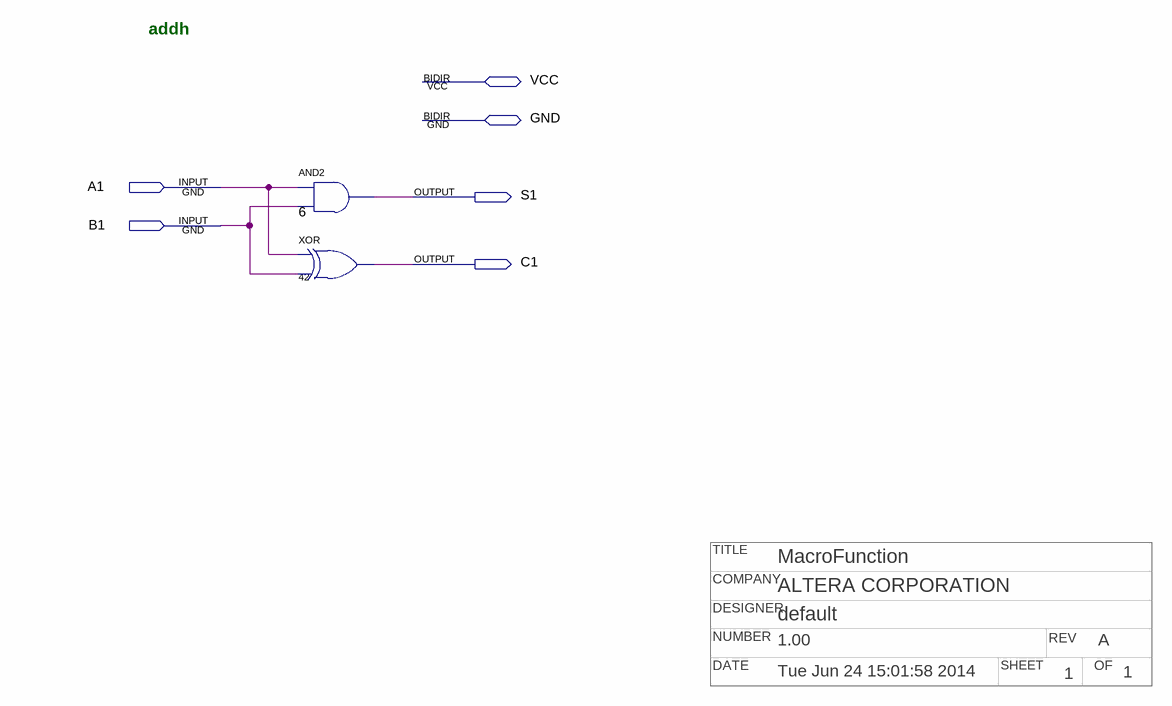
[diagram p0: schematic sheet]
// Quartus schematic npaddh.bdf as structural Verilog: 2 symbols, 6 pins
// Title block: TITLE: MacroFunction; COMPANY: ALTERA CORPORATION; DESIGNER: default; NUMBER: 1.00; REV: A; DATE: Tue Jun 24 15:01:58 2014; SHEET: 1; OF: 1
module npaddh (
  input  A1,
  input  B1,
  inout  VCC,
  inout  GND,
  output S1,
  output C1
);

  and u_6 (S1, A1, B1);
  xor u_42 (C1, A1, B1);

  // Notes on the sheet:
  //   addh
endmodule
